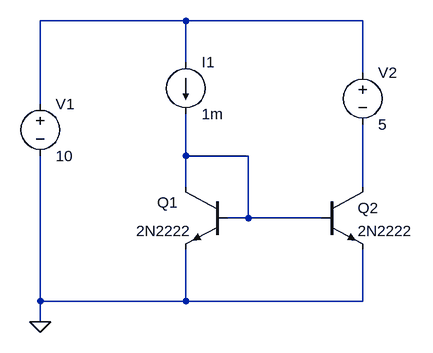
[diagram p0: schematic simu P1 Q1-4.asc]
simu P1 Q1-4.asc, the LTspice schematic file:
Version 4
SHEET 1 880 680
WIRE 256 -128 32 -128
WIRE 528 -128 256 -128
WIRE 256 -64 256 -128
WIRE 528 -48 528 -128
WIRE 32 0 32 -128
WIRE 256 80 256 16
WIRE 352 80 256 80
WIRE 256 128 256 80
WIRE 528 128 528 32
WIRE 352 176 352 80
WIRE 352 176 320 176
WIRE 464 176 352 176
WIRE 32 304 32 80
WIRE 256 304 256 224
WIRE 256 304 32 304
WIRE 528 304 528 224
WIRE 528 304 256 304
WIRE 32 336 32 304
FLAG 32 336 0
SYMBOL current 256 -64 R0
WINDOW 123 0 0 Left 0
WINDOW 39 0 0 Left 0
SYMATTR InstName I1
SYMATTR Value 1m
SYMBOL npn 320 128 M0
WINDOW 0 76 24 Left 2
SYMATTR InstName Q1
SYMATTR Value 2N2222
SYMBOL npn 464 128 R0
SYMATTR InstName Q2
SYMATTR Value 2N2222
SYMBOL voltage 32 -16 R0
WINDOW 123 0 0 Left 0
WINDOW 39 0 0 Left 0
SYMATTR InstName V1
SYMATTR Value 10
SYMBOL voltage 528 -64 R0
WINDOW 123 0 0 Left 0
WINDOW 39 0 0 Left 0
SYMATTR InstName V2
SYMATTR Value 5

The netlist it stands for:
* simu P1 Q1-4.asc
I1 N001 N002 1m
Q1 N002 N002 0 0 2N2222
Q2 N003 N002 0 0 2N2222
V1 N001 0 10
V2 N001 N003 5
.model NPN NPN
.model PNP PNP
.lib standard.bjt
.backanno
.end